# Altium schematic sheet H10R7_Frontend 1.SchDoc
size Letter; CompanyName: Hexabitz; DocumentNumber: 2; Revision: 1; SheetNumber: 3; SheetTotal: 4; Module_Description: Touch Pad; Module_Name: H01R0
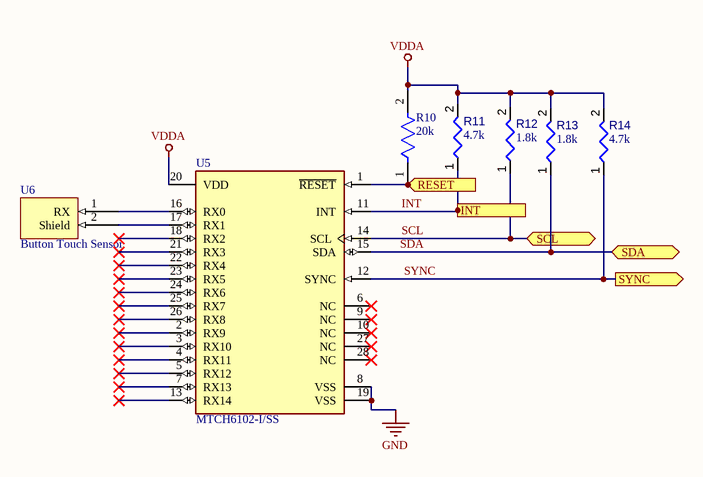
[diagram p0: H10R7_Frontend 1.SchDoc]

## Parts
R10  value 20k  [FP-AC0603-IPC_C]  (hidden comment: AC0603JR-0720KL)
R11  value 4.7k  [RESC1608X55X25ML10T15]  (hidden comment: Resistor 4k7 +/-1% 0603 100 mW)
R12  value 1.8k  [FP-RMCF0603-MFG]  (hidden comment: RMCF0603JG1K80)
R13  value 1.8k  [FP-RMCF0603-MFG]  (hidden comment: RMCF0603JG1K80)
R14  value 4.7k  [RESC1608X55X25ML10T15]  (hidden comment: Resistor 4k7 +/-1% 0603 100 mW)
U5  MTCH6102-I/SS  [FP-C04-073-IPC_A]
U6  Button Touch Sensor  [Button Touch Sensor]

## Ports
INT (out), RESET (in), SCL (bidir), SDA (bidir), SYNC (out)

## Nets
GND: U5.8(VSS) U5.19(VSS)
VDDA: R10.2 R11.2 R12.2 R13.2 R14.2 U5.20(VDD)
INT: R11.1 U5.11(INT) ; port INT
RESET: R10.1 U5.1(~{RESET}) ; port RESET
SCL: R12.1 U5.14(SCL) ; port SCL
SDA: R13.1 U5.15(SDA) ; port SDA
SYNC: R14.1 U5.12(SYNC) ; port SYNC
NetU5_16: U5.16(RX0) U6.1(RX)
NetU5_17: U5.17(RX1) U6.2(Shield)

Not connected (* = marked no-connect by the designer): U5 2(RX9)* 3(RX10)* 4(RX11)* 5(RX12)* 6(NC)* 7(RX13)* 9(NC)* 10(NC)* 13(RX14)* 18(RX2)* 21(RX3)* 22(RX4)* 23(RX5)* 24(RX6)* 25(RX7)* 26(RX8)* 27(NC)* 28(NC)*

## Notes on the sheet
- Module:
- Title:
- Description:
- Size:
- Revision:
- Letter
- www.hexabitz.com
- Date:
- Time:
- Sheet
- of

## Library data of the parts
R10 = CMP-009-00179-1: Res Thick Film 0603 20K Ohm 5% 0.1W(1/10W) ±100ppm/C Pad SMD T/R Automotive AEC-Q200; Power Rating: 100mW; Voltage Rating: 75V; Max Operating Temperature: 155°C; RoHS: Compliant; Tolerance: 5%; Mounting Technology: Surface Mount; Case/Package: 0603; Min Operating Temperature: -55°C
R11 R14 = CMP-009-00031-5: Chip Resistor, 4.7 KOhm, +/- 1%, 0.1 W, -55 to 155 degC, 0603 (1608 Metric); Power: 100mW; Tolerance: 1%; Mounting Technology: SM; Case/Package: 0603; RoHS Compliant: True; Pins: 2; Min Operating Temperature: -55°C; Max Operating Temperature: 155°C
R12 R13 = CMP-009-00180-1: Res Thick Film 0603 1.8K Ohm 5% 1/10W ±200ppm/°C Molded SMD Paper T/R; Voltage Rating: 75V; Mounting Technology: Surface Mount; RoHS: Compliant; Tolerance: 5%; Case/Package: 0603; Max Operating Temperature: 155°C; Min Operating Temperature: -55°C
U5 = CMP-015-00008-1: Sensor Controller Capacitive 15-Ch Serial I2C 28-Pin SSOP Tube; Number of Channels: 15; Max Supply Current: 1.17mA; Min Supply Voltage: 1.8V; Max Supply Voltage: 3.6V; Interface: 2-Wire, I2C; RoHS: Compliant; Max Operating Temperature: 85°C; Mounting Technology: Surface Mount; Pins: 28; Case/Package: SSOP; Min Operating Temperature: -40°C
U6 = CMP-010-00025-1: 1 button touch sensor with shield